# EAGLE design T01_Synth_Glove_v5_nathan_bigboard_DRC_freev2 (EAGLE 7.1.0)
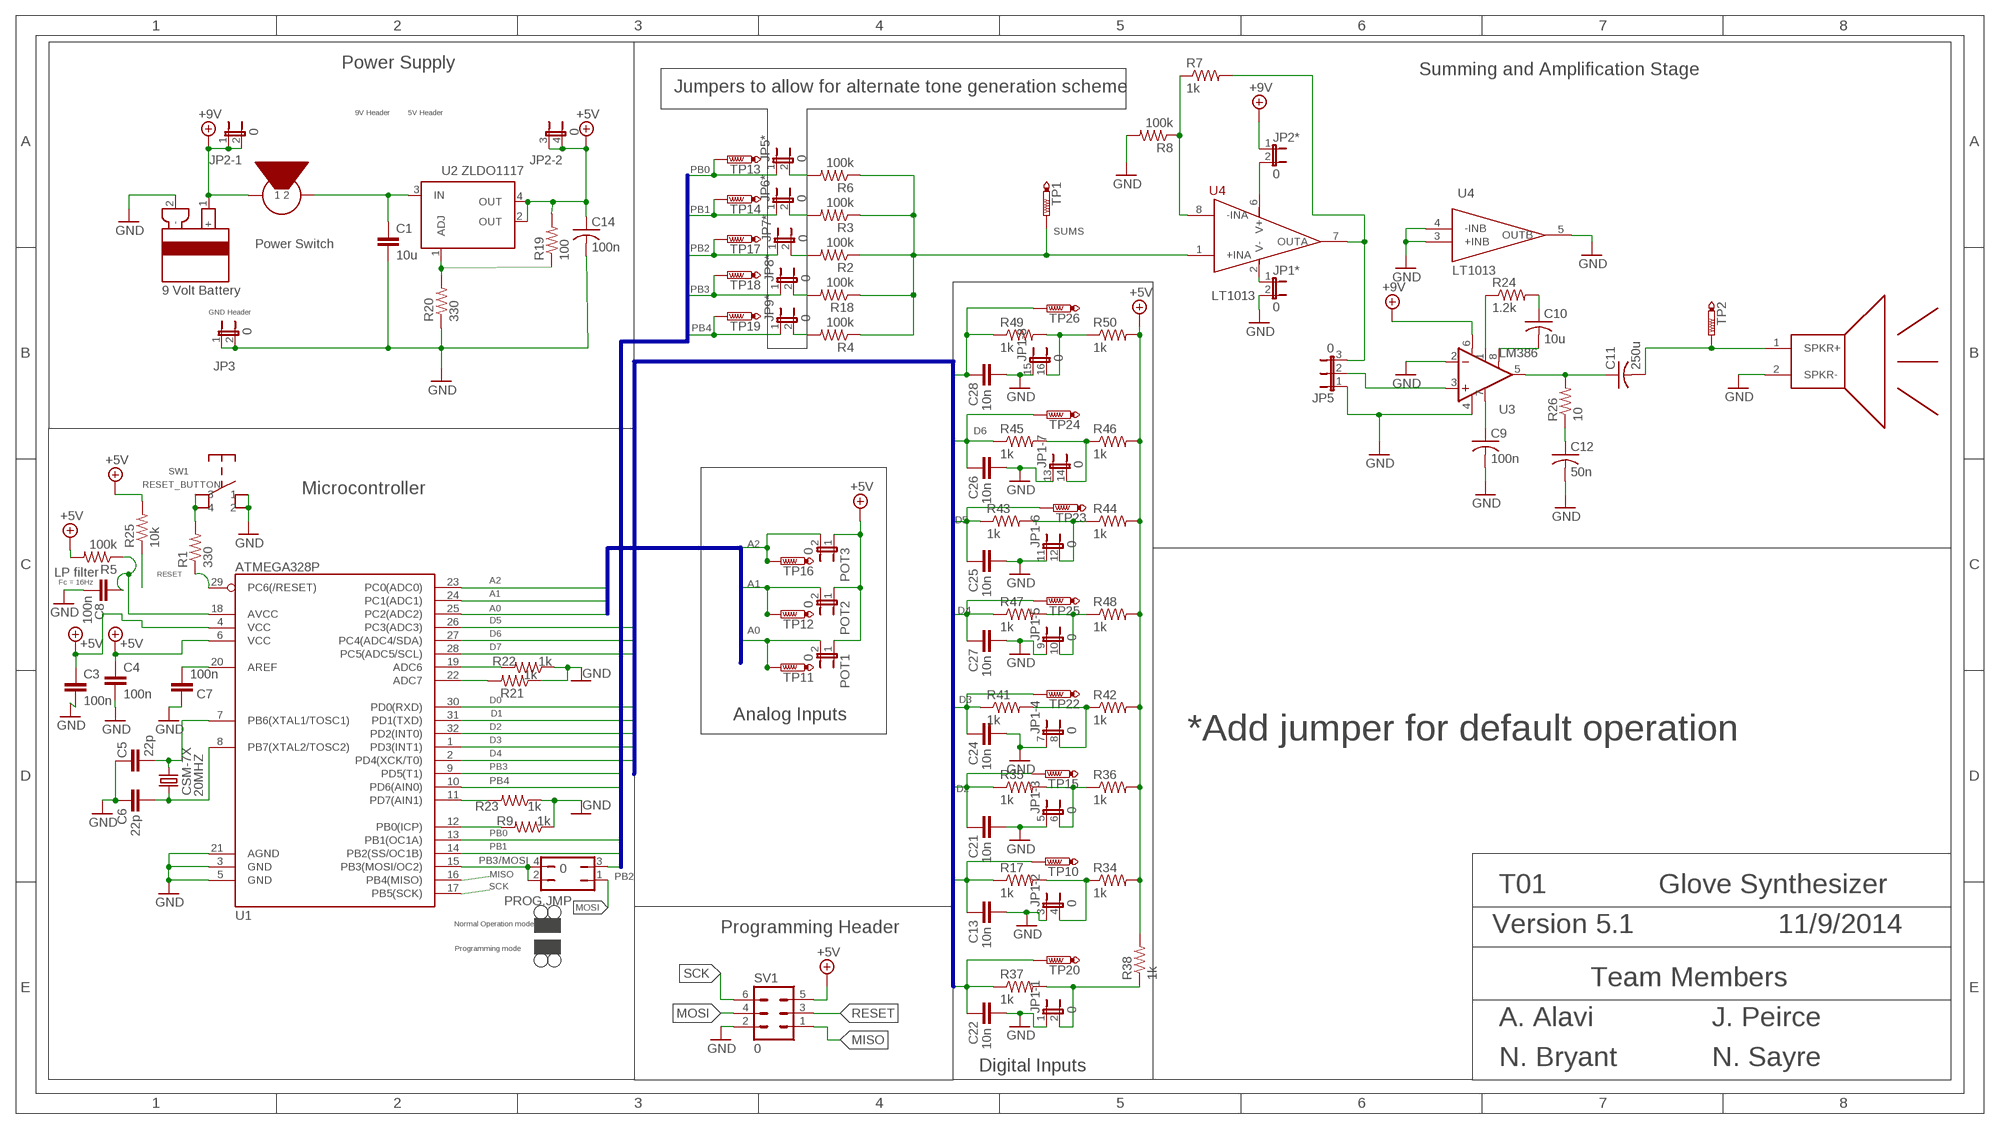
[diagram p0: schematic, sheet 1]

## Parts
20MHZ  CSM-7X  CSM-7X-DU  [CSM-7X-DU]
C1  10u  CAP0603-CAP  [0603-CAP]
C3  100n  CAP0603-CAP  [0603-CAP]
C4  100n  CAP0603-CAP  [0603-CAP]
C5  22p  CAP0603-CAP  [0603-CAP]
C6  22p  CAP0603-CAP  [0603-CAP]
C7  100n  CAP0603-CAP  [0603-CAP]
C8  100n  CAP0603-CAP  [0603-CAP]
C9  100n  C-US025-030X050  [C025-030X050]
C10  10u  C-US025-030X050  [C025-030X050]
C11  250u  C-US025-030X050  [C025-030X050]
C12  50n  C-US025-030X050  [C025-030X050]
C13  10n  CAP0603-CAP  [0603-CAP]
C14  100n  C-US025-030X050  [C025-030X050]
C21  10n  CAP0603-CAP  [0603-CAP]
C22  10n  CAP0603-CAP  [0603-CAP]
C24  10n  CAP0603-CAP  [0603-CAP]
C25  10n  CAP0603-CAP  [0603-CAP]
C26  10n  CAP0603-CAP  [0603-CAP]
C27  10n  CAP0603-CAP  [0603-CAP]
C28  10n  CAP0603-CAP  [0603-CAP]
JP1  0  JP8QE  [JP8Q]
JP1*  0  JP1E  [JP1]
JP2  0  JP2QE  [JP2Q]
JP2*  0  JP1E  [JP1]
JP3  0  JP1E  [JP1]
JP5  0  JP2E  [JP2]
JP5*  0  JP1E  [JP1]
JP6*  0  JP1E  [JP1]
JP7*  0  JP1E  [JP1]
JP8*  0  JP1E  [JP1]
JP9*  0  JP1E  [JP1]
POT1  0  JP1E  [JP1]
POT2  0  JP1E  [JP1]
POT3  0  JP1E  [JP1]
PROG.JMP  0  JP2Q  [JP2Q]
R1  330  RESISTOR0603  [0603-RES]
R2  100k  RESISTOR0603  [0603-RES]
R3  100k  RESISTOR0603  [0603-RES]
R4  100k  RESISTOR0603  [0603-RES]
R5  100k  RESISTOR0603  [0603-RES]
R6  100k  RESISTOR0603  [0603-RES]
R7  1k  RESISTOR0603  [0603-RES]
R8  100k  RESISTOR0603  [0603-RES]
R9  1k  RESISTOR0603  [0603-RES]
R17  1k  RESISTOR0603  [0603-RES]
R18  100k  RESISTOR0603  [0603-RES]
R19  100  RESISTOR0603  [0603-RES]
R20  330  RESISTOR0603  [0603-RES]
R21  1k  RESISTOR0603  [0603-RES]
R22  1k  RESISTOR0603  [0603-RES]
R23  1k  RESISTOR0603  [0603-RES]
R24  1.2k  R-US_0204/2V  [0204V]
R25  10k  RESISTOR0603  [0603-RES]
R26  10  R-US_0204/2V  [0204V]
R34  1k  RESISTOR0603  [0603-RES]
R35  1k  RESISTOR0603  [0603-RES]
R36  1k  RESISTOR0603  [0603-RES]
R37  1k  RESISTOR0603  [0603-RES]
R38  1k  RESISTOR0603  [0603-RES]
R41  1k  RESISTOR0603  [0603-RES]
R42  1k  RESISTOR0603  [0603-RES]
R43  1k  RESISTOR0603  [0603-RES]
R44  1k  RESISTOR0603  [0603-RES]
R45  1k  RESISTOR0603  [0603-RES]
R46  1k  RESISTOR0603  [0603-RES]
R47  1k  RESISTOR0603  [0603-RES]
R48  1k  RESISTOR0603  [0603-RES]
R49  1k  RESISTOR0603  [0603-RES]
R50  1k  RESISTOR0603  [0603-RES]
SV1  0  MA03-2  [MA03-2]
SW1  RESET_BUTTON  [RESET_BUTTON]
TP1  PTR1B2,54  [B2,54]
TP2  PTR1B2,54  [B2,54]
TP10  PTR1B2,54  [B2,54]
TP11  PTR1B2,54  [B2,54]
TP12  PTR1B2,54  [B2,54]
TP13  PTR1B2,54  [B2,54]
TP14  PTR1B2,54  [B2,54]
TP15  PTR1B2,54  [B2,54]
TP16  PTR1B2,54  [B2,54]
TP17  PTR1B2,54  [B2,54]
TP18  PTR1B2,54  [B2,54]
TP19  PTR1B2,54  [B2,54]
TP20  PTR1B2,54  [B2,54]
TP22  PTR1B2,54  [B2,54]
TP23  PTR1B2,54  [B2,54]
TP24  PTR1B2,54  [B2,54]
TP25  PTR1B2,54  [B2,54]
TP26  PTR1B2,54  [B2,54]
U1  ATMEGA328P  ATMEGA328_SMT  [TQFP32-08]
U2  ZLDO1117  [SOT223]
U3  LM386  [DIP08]
U4  LT1013  [SO08]
U$1  SPEAKER  [JP1]
U$7  POWER_SWITCH  [JP1]
U$8  9VOLTBATTERY  [JP1]

## Nets
+5V: C3.1 C4.1 C14.1 JP2.3 JP2.4 POT1.1 POT2.1 POT3.1 R5.2 R19.2 R25.2 R34.2 R36.2 R38.2 R42.2 R44.2 R46.2 R48.2 R50.2 SV1.5 U1.4(VCC) U1.6(VCC) U2.2(OUT) U2.4(OUT)
+9V: JP2*.1 JP2.1 JP2.2 U3.6(V+) U$7.1 U$8.1(+)
A0: POT1.2 TP11.TP U1.25(PC2(ADC2))
A1: POT2.2 TP12.TP U1.24(PC1(ADC1))
A2: POT3.2 TP16.TP U1.23(PC0(ADC0))
D0: C22.2 R37.1 TP20.TP U1.30(PD0(RXD))
D1: C13.2 R17.1 TP10.TP U1.31(PD1(TXD))
D2: C21.2 R35.1 TP15.TP U1.32(PD2(INT0))
D3: C24.2 R41.1 TP22.TP U1.1(PD3(INT1))
D4: C27.2 R47.1 TP25.TP U1.2(PD4(XCK/T0))
D5: C25.2 R43.1 TP23.TP U1.26(PC3(ADC3))
D6: C26.2 R45.1 TP24.TP U1.27(PC4(ADC4/SDA))
D7: C28.2 R49.1 TP26.TP U1.28(PC5(ADC5/SCL))
GND: C1.2 C3.2 C4.2 C5.2 C6.2 C7.2 C8.2 C9.2 C12.2 C13.1 C14.2 C21.1 C22.1 C24.1 C25.1 C26.1 C27.1 C28.1 JP1*.2 JP1.1 JP1.3 JP1.5 JP1.7 JP1.9 JP1.11 JP1.13 JP1.15 JP3.1 JP3.2 JP5.1 R8.2 R9.1 R20.1 R21.1 R22.1 R23.1 SV1.2 SW1.1 SW1.2 U1.3(GND) U1.5(GND) U1.21(AGND) U3.2(-IN) U3.4(V-) U4.3(+INB) U4.4(-INB) U4.5(OUTB) U$1.2(SPKR-) U$8.2(-)
MISO: SV1.1 U1.16(PB4(MISO))
MOSI: PROG.JMP.1 SV1.4
N$1: C7.1 U1.20(AREF)
N$2: JP1.8 R41.2 R42.1
N$3: JP1.12 R43.2 R44.1
N$4: R1.1 U1.29(PC6(/RESET))
N$6: 20MHZ.1 C5.1 U1.7(PB6(XTAL1/TOSC1))
N$7: 20MHZ.2 C6.1 U1.8(PB7(XTAL2/TOSC2))
N$8: C8.1 R5.1 U1.18(AVCC)
N$9: R21.2 U1.22(ADC7)
N$10: R22.2 U1.19(ADC6)
N$13: JP1.6 R35.2 R36.1
N$16: R7.1 R8.1 U4.8(-INA)
N$17: R9.2 U1.12(PB0(ICP))
N$18: JP5*.2 R6.2
N$21: JP9*.2 R4.2
N$22: R1.2 SW1.3 SW1.4
N$23: JP1.4 R17.2 R34.1
N$25: JP8*.2 R18.2
N$27: C10.1 R24.2
N$31: C11.2 TP2.TP U$1.1(SPKR+)
N$32: JP7*.2 R2.2
N$34: JP2*.2 U4.6(V+)
N$36: JP5.3 R7.2 U4.7(OUTA)
N$37: R19.1 R20.2 U2.1(ADJ)
N$38: C1.1 U2.3(IN) U$7.2
N$39: JP6*.2 R3.2
N$40: R24.1 U3.1(GAIN)
N$41: C10.2 U3.8(GAIN)
N$43: JP1.2 R37.2 R38.1
N$44: JP5.2 U3.3(+IN)
N$47: C9.1 U3.7(BP)
N$49: C11.1 R26.2 U3.5(OUT)
N$50: C12.1 R26.1
N$51: JP1.14 R45.2 R46.1
N$52: JP1.10 R47.2 R48.1
N$53: JP1.16 R49.2 R50.1
PB0: JP5*.1 TP13.TP U1.13(PB1(OC1A))
PB1: JP6*.1 TP14.TP U1.14(PB2(SS/OC1B))
PB2: JP7*.1 PROG.JMP.3 TP17.TP
PB3: JP8*.1 TP18.TP U1.9(PD5(T1))
PB3/MOSI: PROG.JMP.2 PROG.JMP.4 U1.15(PB3(MOSI/OC2))
PB4: JP9*.1 TP19.TP U1.10(PD6(AIN0))
PD7: R23.2 U1.11(PD7(AIN1))
RESET: R25.1 SV1.3
SCK: SV1.6 U1.17(PB5(SCK))
SUMS: R2.1 R3.1 R4.1 R6.1 R18.1 TP1.TP U4.1(+INA)
V-: JP1*.1 U4.2(V-)

## Buses
D[0..7]
PB[0..4]
A[0..2]

## Notes on the sheet
- Power Supply
- Summing and Amplification Stage
- Jumpers to allow for alternate tone generation scheme
- 9V Header | 5V Header
- Power Switch
- GND Header
- Microcontroller
- LP filter
- Fc = 16Hz
- Analog Inputs
- *Add jumper for default operation
- T01 | Glove Synthesizer
- Normal Operation mode
- Programming Header | Version 5.1 | 11/9/2014
- Programming mode
- Team Members
- A. Alavi | J. Peirce
- Digital Inputs
- N. Bryant | N. Sayre

## Library data of the parts
20MHZ = crystal:CSM-7X-DU: SMD CRYSTAL Source: www.ecsxtal.com .. Crystal 3.6864MHz CSM_7X_DU.PDF; OC_FARNELL: unknown; OC_NEWARK: unknown
C1 C3-C8 C13 C21 C22 C24-C28 = SparkFun-Capacitors:CAP: Capacitor Standard 0603 ceramic capacitor, and 0.1" leaded capacitor.
C9-C12 C14 = adafruit:C-US: CAPACITOR, American symbol
JP1 = jumper:JP8QE: JUMPER
JP1* JP2* JP3 JP5* JP6* JP7* JP8* JP9* POT1-POT3 = jumper:JP1E: JUMPER
JP2 = jumper:JP2QE: JUMPER
JP5 = jumper:JP2E: JUMPER
PROG.JMP = jumper:JP2Q: JUMPER
R1-R9 R17-R23 R25 R34-R38 R41-R50 = SparkFun-Resistors:RESISTOR: Resistor Basic schematic elements and footprints for 0603, 1206, and PTH resistors.
R24 R26 = adafruit:R-US_: RESISTOR, American symbol
SV1 = con-lstb:MA03-2: PIN HEADER; OC_FARNELL: unknown; OC_NEWARK: unknown
SW1 = Synth_Glove:RESET_BUTTON
TP1 TP2 TP10-TP20 TP22-TP26 = testpad:PTR1: TEST PIN
U1 = SparkFun-DigitalIC:ATMEGA328_SMT: 32-Pin Atmega328 part Commonly used on Arduino compatible boards Available in QFP and QFN packages TQFP is IC-09069 QFN is non-stock; PROD_ID: IC-09069
U2 = Synth_Glove:ZLDO1117
U3 = SparkFun-AnalogIC:LM386: low voltage audio power amplifier
U4 = Synth_Glove:LT1013: Linear Technology dual input precision op amps
U$1 = Synth_Glove:SPEAKER
U$7 = Synth_Glove:POWER_SWITCH
U$8 = Synth_Glove:9VOLTBATTERY

## Board
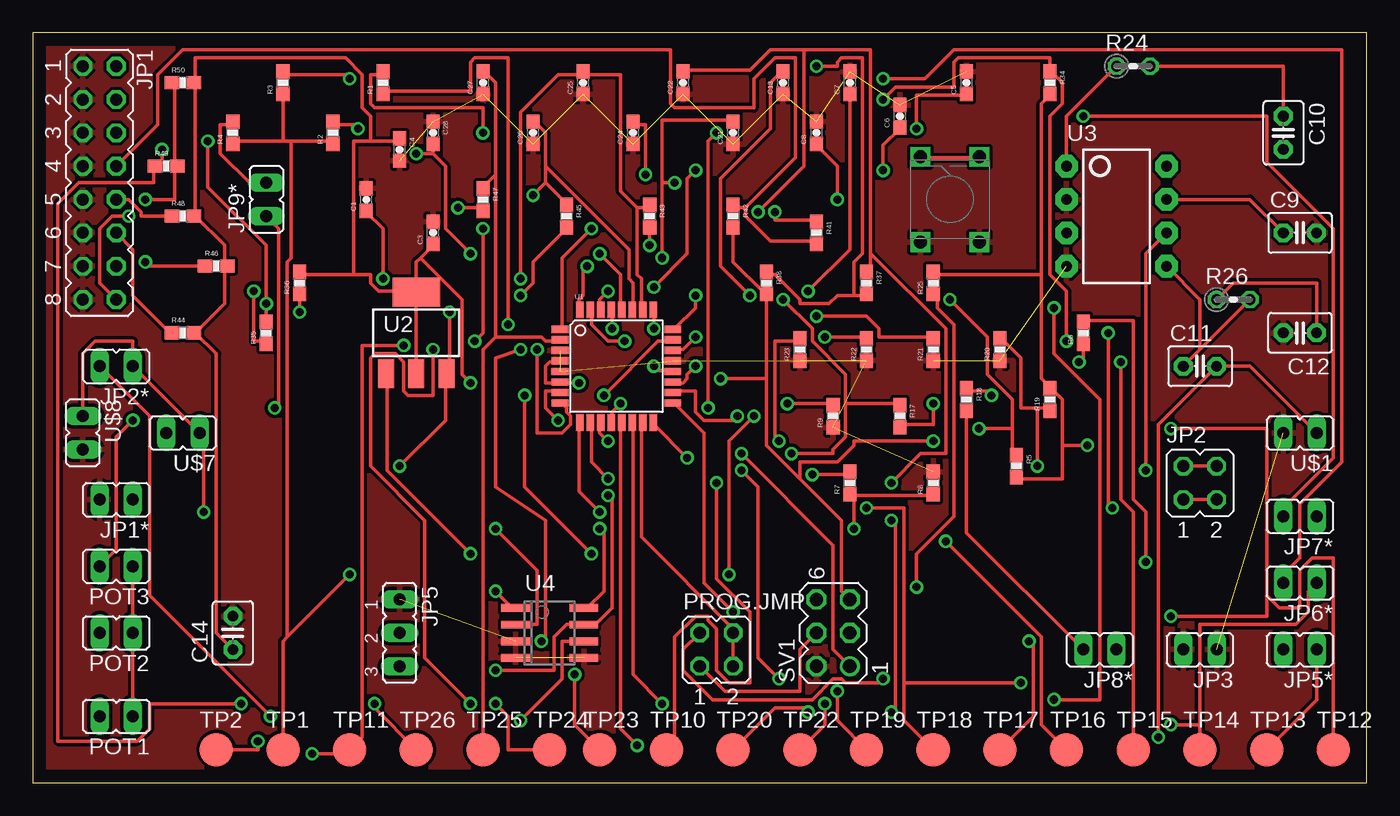
[diagram p1: board, top side]
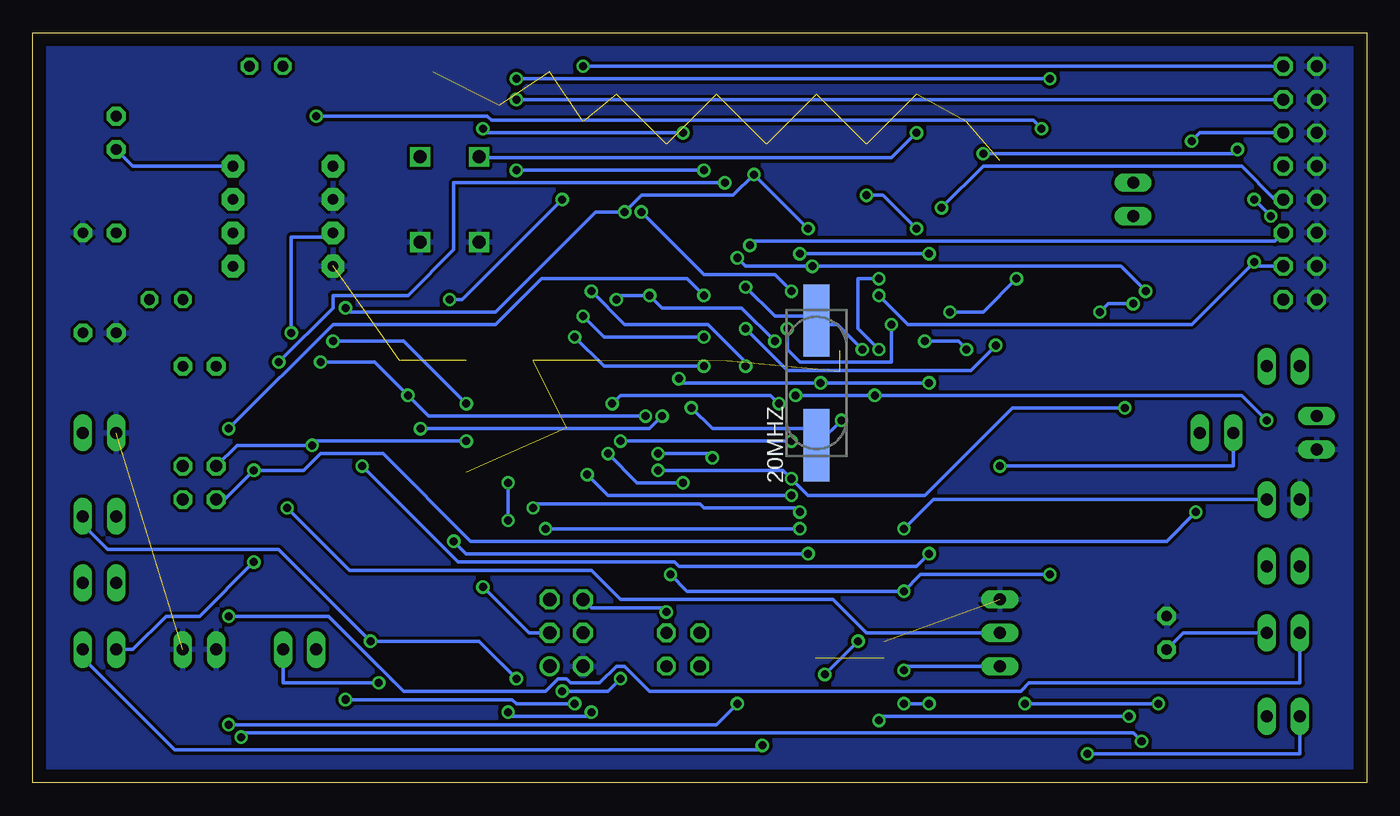
[diagram p2: board, bottom side, seen from below]

Size 101.6 x 57.15 mm. Coordinates in mm from the lower left corner, seen from the top.
Outline: 0,0 101.6,0 101.6,57.15 0,57.15 0,0
Copper layers (1*16): Top 0.035mm / dielectric 1.5mm / Bottom 0.035mm
Design rules "default": minimum track width 10mil, minimum drill 24mil, track to track 8mil, track to pad 8mil, pad to pad 8mil, via to via 8mil, smd to smd 8mil, copper to edge 40mil, drill to drill 8mil, minimum pad ring 10mil, minimum via ring 8mil, stop-mask expansion 4mil, vias tented up to drill 0mil, thermal gap 10mil

### Footprints (pad centres in the part's own frame; a part is rotated, then mirrored left to right if it is on the bottom)
CSM-7X-DU = smd 5.5 x 2: 1 -4.75,0; 2 4.75,0
0603-CAP = smd 1.1 x 1: 1 -0.85,0; 2 0.85,0
C025-030X050 = drill 0.813 pad 1.422 octagon: 1 -1.27,0; 2 1.27,0
JP8Q = drill 0.914 octagon: 1 -8.89,-1.27; 2 -8.89,1.27; 3 -6.35,-1.27; 4 -6.35,1.27; 5 -3.81,-1.27; 6 -3.81,1.27; 7 -1.27,-1.27; 8 -1.27,1.27; 9 1.27,-1.27; 10 1.27,1.27; 11 3.81,-1.27; 12 3.81,1.27; 13 6.35,-1.27; 14 6.35,1.27; 15 8.89,-1.27; 16 8.89,1.27
JP1 = drill 0.914 long: 1 0,-1.27; 2 0,1.27
JP2Q = drill 0.914 octagon: 1 -1.27,-1.27; 2 1.27,-1.27; 3 -1.27,1.27; 4 1.27,1.27
JP2 = drill 0.914 long: 1 -2.54,0; 2 0,0; 3 2.54,0
0603-RES = smd 1.1 x 1: 1 -0.85,0; 2 0.85,0
0204V = drill 0.813 octagon: 1 -1.27,0; 2 1.27,0
MA03-2 = drill 1.016: 1 -2.54,-1.27 | drill 1.016 octagon: 2 -2.54,1.27; 3 0,-1.27; 4 0,1.27; 5 2.54,-1.27; 6 2.54,1.27
RESET_BUTTON = drill 0.991 square: 1 3.251,2.248; 2 3.251,-2.248; 3 -3.251,2.248; 4 -3.251,-2.248
B2,54 = smd 2.54 x 2.54: TP 0,0
TQFP32-08 = smd 1.27 x 0.559: 1 -4.293,2.8; 2 -4.293,2; 3 -4.293,1.2; 4 -4.293,0.4; 5 -4.293,-0.4; 6 -4.293,-1.2; 7 -4.293,-2; 8 -4.293,-2.8; 17 4.293,-2.8; 18 4.293,-2; 19 4.293,-1.2; 20 4.293,-0.4; 21 4.293,0.4; 22 4.293,1.2; 23 4.293,2; 24 4.293,2.8 | smd 0.559 x 1.27: 9 -2.8,-4.293; 10 -2,-4.293; 11 -1.2,-4.293; 12 -0.4,-4.293; 13 0.4,-4.293; 14 1.2,-4.293; 15 2,-4.293; 16 2.8,-4.293; 25 2.8,4.293; 26 2,4.293; 27 1.2,4.293; 28 0.4,4.293; 29 -0.4,4.293; 30 -1.2,4.293; 31 -2,4.293; 32 -2.8,4.293
SOT223 = smd 1.219 x 2.235: 1 -2.311,-3.099; 2 0,-3.099; 3 2.311,-3.099 | smd 3.6 x 2.2: 4 0,3.099
DIP08 = drill 0.813 pad 1.727 octagon: 1 -3.81,-3.81; 2 -1.27,-3.81; 3 1.27,-3.81; 4 3.81,-3.81; 5 3.81,3.81; 6 1.27,3.81; 7 -1.27,3.81; 8 -3.81,3.81
SO08 = smd 0.6 x 2.2: 1 -1.905,-2.6; 2 -0.635,-2.6; 3 0.635,-2.6; 4 1.905,-2.6; 5 1.905,2.6; 6 0.635,2.6; 7 -0.635,2.6; 8 -1.905,2.6

### Placement (x,y rotation side)
20MHZ  41.91,30.48 90 bottom
C1  25.4,44.45 90 top
C3  30.48,41.91 90 top
C4  27.94,48.26 270 top
C5  71.12,53.34 90 top
C6  66.04,50.8 90 top
C7  62.23,53.34 90 top
C8  59.69,49.53 90 top
C9  96.52,41.91 0 top
C10  95.25,49.53 270 top
C11  88.9,31.75 0 top
C12  96.52,34.29 180 top
C13  57.15,53.34 90 top
C14  15.24,11.43 90 top
C21  53.34,49.53 90 top
C22  49.53,53.34 90 top
C24  45.72,49.53 90 top
C25  41.91,53.34 90 top
C26  38.1,49.53 90 top
C27  34.29,53.34 90 top
C28  30.48,49.53 270 top
JP1  5.08,45.72 270 top
JP1*  6.35,21.59 90 top
JP2  88.9,22.86 0 top
JP2*  6.35,31.75 90 top
JP3  88.9,10.16 90 top
JP5  27.94,11.43 270 top
JP5*  96.52,10.16 90 top
JP6*  96.52,15.24 90 top
JP7*  96.52,20.32 90 top
JP8*  81.28,10.16 90 top
JP9*  17.78,44.45 0 top
POT1  6.35,5.08 90 top
POT2  6.35,11.43 90 top
POT3  6.35,16.51 90 top
PROG.JMP  52.07,10.16 0 top
R1  26.67,53.34 90 top
R2  22.86,49.53 90 top
R3  19.05,53.34 90 top
R4  15.24,49.53 90 top
R5  74.93,24.13 270 top
R6  80.01,34.29 90 top
R7  62.23,22.86 90 top
R8  68.58,22.86 90 top
R9  60.96,27.94 90 top
R17  66.04,27.94 270 top
R18  71.12,29.21 270 top
R19  77.47,29.21 90 top
R20  73.66,33.02 90 top
R21  68.58,33.02 90 top
R22  63.5,33.02 90 top
R23  58.42,33.02 90 top
R24  83.82,54.61 0 top
R25  68.58,38.1 90 top
R26  91.44,36.83 0 top
R34  77.47,53.34 270 top
R35  17.78,34.29 90 top
R36  20.32,38.1 90 top
R37  63.5,38.1 270 top
R38  55.88,38.1 270 top
R41  59.69,41.91 270 top
R42  53.34,43.18 270 top
R43  46.99,43.18 270 top
R44  11.43,34.29 0 top
R45  40.64,43.18 270 top
R46  13.97,39.37 0 top
R47  34.29,44.45 270 top
R48  11.43,43.18 0 top
R49  10.16,46.99 0 top
R50  11.43,53.34 0 top
SV1  60.96,11.43 90 top
SW1  69.85,44.45 270 top
TP1  19.05,2.54 0 top
TP2  13.97,2.54 0 top
TP10  48.26,2.54 0 top
TP11  24.13,2.54 0 top
TP12  99.06,2.54 0 top
TP13  93.98,2.54 0 top
TP14  88.9,2.54 0 top
TP15  83.82,2.54 0 top
TP16  78.74,2.54 0 top
TP17  73.66,2.54 0 top
TP18  68.58,2.54 0 top
TP19  63.5,2.54 0 top
TP20  53.34,2.54 0 top
TP22  58.42,2.54 0 top
TP23  43.18,2.54 0 top
TP24  39.37,2.54 0 top
TP25  34.29,2.54 0 top
TP26  29.21,2.54 0 top
U1  44.45,31.75 0 top
U2  29.21,34.29 0 top
U3  82.55,43.18 270 top
U4  39.37,11.43 270 top
U$1  96.52,26.67 90 top
U$7  11.43,26.67 90 top
U$8  3.81,26.67 180 top

### Tracks (layer width: path | path; a pad name or v marks a point on that pad's centre or on a via)
+5V  (via drill 0.61)
  Top 0.254: JP2.4 JP2.3 | 78.42,25.72 78.42,29.21 77.47,30.16 | 78.42,25.72 78.42,23.18 74.93,23.18 R5.2 | 76.83,38.73 68.58,38.73 R25.2 | 76.83,38.73 76.83,30.8 77.47,30.16 | 77.47,30.16 R19.2 | 76.83,38.73 76.83,51.75 77.47,52.39 R34.2 | 78.42,25.72 v80.33,25.72 | R42.2 53.34,39.69 55.56,37.47 55.88,37.47 R38.2 55.88,30.8 | SV1.5 61.59,14.61 61.59,20 58.42,23.18 | 58.42,23.18 55.88,25.72 55.88,30.8 | U1.4 40.01,32.07 39.37,32.07 39.05,31.75 39.05,30.48 40.01,30.48 U1.6 40.32,30.48 v41.59,30.48 | 24.45,38.73 25.72,38.73 25.72,38.1 26.35,37.47 29.21,37.47 | 24.45,38.73 20.32,38.73 R36.2 | 29.53,40.01 29.21,39.69 29.21,37.47 | 29.53,40.01 30.48,40.96 C3.1 | 29.21,37.47 U2.4 U2.2 | 25.72,48.9 24.45,48.9 24.45,38.73 | 25.72,48.9 27.94,48.9 C4.1 | v33.34,30.48 32.7,31.11 32.7,36.83 29.53,40.01 | 12.38,34.29 14.61,36.51 14.61,39.37 | 12.38,43.18 14.61,40.96 14.61,39.37 | 14.61,39.37 R46.2 | 12.38,43.18 12.38,53.34 | 12.38,43.18 R48.2 | POT1.1 POT2.1 POT3.1 | 12.38,34.29 13.97,32.7 13.97,11.43 C14.1 | 12.38,34.29 R44.2 | 25.72,48.9 25.72,50.8 25.08,51.44 25.08,53.98 23.81,55.24 12.38,55.24 12.38,53.34 | 12.38,53.34 R50.2 | v52.39,30.8 55.88,30.8 | v68.58,26.04 62.55,26.04 62.55,25.72 61.28,24.45 58.42,24.45 58.42,23.18
  Bottom 0.254: JP2.3 86.04,25.72 v80.33,25.72 80.01,26.04 v68.58,26.04 | v33.34,30.48 v41.59,30.48 52.07,30.48 v52.39,30.8 | C14.1 13.97,11.43 POT2.1
+9V  (via drill 0.61)
  Top 0.254: U$8.1 3.81,32.7 4.76,33.66 7.62,33.66 JP2*.1 U$7.1 13.02,26.35 v13.02,20.64 | JP2.2 JP2.1 | U3.6 84.77,40.32 v84.77,23.81
  Bottom 0.254: JP2.1 87,21.59 v84.77,23.81 80.96,23.81 79.69,25.08 74.93,25.08 68.26,18.41 15.24,18.41 v13.02,20.64
A0  (via drill 0.61)
  Top 0.254: v47.31,34.61 47.31,35.88 U1.25 | v28.26,33.34 25.08,33.34 25.08,3.49 TP11.TP 24.13,2.22 v21.27,2.22
  Bottom 0.254: v47.31,34.61 44.13,31.43 30.16,31.43 v28.26,33.34 | POT1.2 5.08,2.22 v21.27,2.22
A1  (via drill 0.61)
  Top 0.254: v50.48,37.15 50.48,36.2 48.9,34.61 U1.24 | v86.68,26.99 93.98,26.99 93.98,14.29 | 93.98,14.29 94.93,13.34 96.52,13.34 96.52,16.19 97.47,17.14 99.06,17.14 TP12.TP | v86.68,12.7 93.98,12.7 93.98,14.29
  Bottom 0.254: v50.48,37.15 51.75,38.42 62.87,38.42 66.36,34.92 78.74,34.92 v86.68,26.99 | POT2.2 5.08,7.62 25.72,7.62 26.35,6.99 54.61,6.99 56.52,8.89 57.15,8.89 58.42,7.62 60.64,7.62 60.96,7.94 61.59,7.94 62.55,6.99 73.34,6.99 79.06,12.7 v86.68,12.7
A2  (via drill 0.61)
  Top 0.254: v43.5,29.53 47.62,33.66 48.58,33.66 U1.23 | v7.62,27.62 6.35,26.35 6.35,17.78 POT3.2 | TP16.TP 76.83,4.45 76.83,11.11 v69.53,18.41 | v42.55,17.46 37.47,22.54 v37.47,29.53
  Bottom 0.254: v43.5,29.53 v37.47,29.53 9.53,29.53 v7.62,27.62 | v69.53,18.41 68.58,17.46 v42.55,17.46
D0  (via drill 0.61)
  Top 0.254: 58.74,55.88 63.82,55.88 63.82,40.32 | 58.74,55.88 56.2,55.88 54.61,54.29 49.53,54.29 C22.2 | 63.82,40.32 63.82,39.37 63.5,39.05 R37.1 | v43.81,37.47 43.18,36.83 43.18,36.2 U1.30 | v55.24,43.5 58.74,46.99 58.74,55.88 | TP20.TP 56.52,5.71 59.05,5.71 v59.05,5.4 | v65.41,5.4 65.72,5.71 65.72,19.68 v65.41,20 | v65.41,22.86 67.63,25.08 69.53,25.08 69.53,34.61 63.82,40.32
  Bottom 0.254: v43.81,37.47 45.09,38.73 50.48,38.73 v55.24,43.5 | v59.05,5.4 59.37,5.08 65.09,5.08 v65.41,5.4 | v65.41,22.86 v65.41,20
D1  (via drill 0.61)
  Top 0.254: 61.91,28.89 66.04,28.89 R17.1 | 61.91,28.89 61.91,31.11 59.37,33.66 59.37,34.61 v57.15,36.83 | v54.61,37.15 52.39,39.37 52.39,46.04 56.2,49.85 56.2,53.34 57.15,54.29 C13.2 | v45.09,33.66 43.81,33.66 42.55,34.92 42.55,35.88 U1.31 | TP10.TP 48.9,3.17 48.9,11.11 50.48,12.7 51.44,12.7 51.44,12.38 52.07,11.75 52.07,8.57 53.02,7.62 54.61,7.62 54.61,13.02 52.07,15.56 v52.07,22.86 | v57.78,25.08 60.96,25.08 60.96,25.4 61.91,26.35 61.91,28.89
  Bottom 0.254: v57.15,36.83 56.83,37.15 v54.61,37.15 53.66,36.2 47.62,36.2 v45.09,33.66 | v52.07,22.86 55.56,22.86 v57.78,25.08
D2  (via drill 0.61)
  Top 0.254: v16.83,37.47 16.83,33.66 17.78,33.66 R35.1 | v42.23,39.37 41.91,39.05 41.91,37.15 41.59,36.83 41.59,36.2 U1.32 | v47.94,40.01 47.94,45.72 | 47.94,45.72 47.94,50.48 53.34,50.48 C21.2 | TP15.TP 83.82,20.64 82.87,21.59 v82.87,32.07 | 47.94,45.72 v48.9,45.72
  Bottom 0.254: v16.83,37.47 18.73,39.37 v42.23,39.37 47.31,39.37 v47.94,40.01 | v82.87,32.07 78.74,36.2 78.74,37.15 73.03,37.15 69.53,40.64 69.53,45.72 v48.9,45.72
D3  (via drill 0.61)
  Top 0.254: v46.67,46.35 46.67,50.16 45.72,50.16 C24.2 | v42.55,42.23 40.32,40.01 40.32,34.61 U1.1 | v56.52,43.5 56.52,42.86 59.69,42.86 R41.1 | TP22.TP 60.33,4.45 v60.33,6.03 | v77.79,6.35 81.28,6.35 81.28,29.21 77.79,32.7 v77.79,36.2
  Bottom 0.254: v42.55,42.23 v46.67,46.35 48.26,44.77 55.24,44.77 v56.52,43.5 58.74,43.5 66.36,35.88 77.47,35.88 v77.79,36.2 | v60.33,6.03 64.77,6.03 65.09,6.35 v77.79,6.35
D4
  Top 0.254: 35.24,46.35 34.29,45.4 R47.1 | 35.24,46.35 35.24,53.34 34.29,54.29 C27.2 | 35.24,33.97 38.73,33.97 39.05,33.66 40.01,33.66 U1.2 | 35.24,46.35 35.24,33.97 | TP25.TP 34.29,33.02 35.24,33.97
D5  (via drill 0.61)
  Top 0.254: 46.04,43.81 46.99,43.81 R43.1 | 46.04,43.81 46.04,38.73 46.35,38.42 46.35,36.2 U1.26 | 41.91,53.98 44.77,53.98 44.77,45.09 46.04,43.81 | TP23.TP 41.27,4.45 v41.27,8.26 | v38.73,10.79 39.05,11.11 39.05,20 35.24,22.54 35.24,32.38 v37.15,33.02 | v37.15,38.42 37.15,51.12 40.01,53.98 41.91,53.98 | 41.91,53.98 C25.2
  Bottom 0.254: v38.73,10.79 v41.27,8.26 | v37.15,33.02 38.73,34.61 38.73,38.42 v37.15,38.42
D6  (via drill 0.61)
  Top 0.254: 39.05,45.72 40.64,44.13 R45.1 | 39.05,46.99 39.05,49.53 38.1,50.48 C26.2 | 39.05,46.99 39.05,45.72 | 39.05,46.99 45.4,40.64 45.4,38.42 45.72,38.1 45.72,36.2 U1.27 | TP24.TP 36.2,2.54 36.2,5.08 v35.24,6.03 | v33.34,6.03 29.84,9.53 29.84,20 25.72,24.13 25.72,32.38 26.04,32.7 27.62,32.7 28.26,32.07 28.26,29.84 28.57,29.53 30.48,29.53 v30.48,33.02 | v33.66,33.66 34.29,34.29 v34.29,42.23 | 39.05,45.72 v38.1,44.77
  Bottom 0.254: v33.34,6.03 v35.24,6.03 | v30.48,33.02 31.11,33.66 v33.66,33.66 | v34.29,42.23 36.83,44.77 v38.1,44.77
D7  (via drill 0.61)
  Top 0.254: v9.84,48.26 9.84,47.31 9.53,46.99 R49.1 9.21,46.99 9.21,45.72 3.49,45.72 1.91,44.13 1.91,3.17 7.94,3.17 8.89,4.13 8.89,6.03 v15.88,6.03 | 30.48,47.94 v29.21,47.94 | C28.2 30.48,47.94 | v43.18,40.32 44.77,38.73 44.77,36.2 U1.28 | v33.34,40.32 31.43,42.23 31.43,46.99 30.48,47.94 | TP26.TP 26.04,5.71 v26.04,6.03
  Bottom 0.254: v9.84,48.26 10.16,47.94 v29.21,47.94 | v33.34,40.32 v43.18,40.32 | v15.88,6.03 v26.04,6.03
GND  (23 unrouted)
  pour Bottom (isolate 0.254): 101.6,0 0,0 0,57.15 101.6,57.15
  pour Top (isolate 0.254): 0,57.15 0,0 101.6,0 101.6,1.27 101.6,57.15
MISO  (via drill 0.61)
  Top 0.254: v49.85,24.77 47.31,27.3 U1.16 | v53.98,25.08 60.96,18.1 60.96,10.16 SV1.1
  Bottom 0.254: v49.85,24.77 50.16,25.08 v53.98,25.08
MOSI
  Top 0.254: PROG.JMP.1 52.7,6.99 58.42,6.99 58.42,10.16 SV1.4
N$1  (via drill 0.61)
  Top 0.254: C7.1 62.23,40.64 v59.05,37.47 | v47.31,31.75 47.62,31.43 48.58,31.43 U1.20
  Bottom 0.254: v59.05,37.47 56.52,34.92 50.16,34.92 47.31,32.07 v47.31,31.75
N$2
  Top 0.254: 54.29,43.81 53.34,43.81 R42.1 | 54.29,43.81 54.29,43.18 56.2,41.27 59.69,41.27 R41.2 | JP1.8 9.53,50.16 9.53,53.98 11.43,55.88 48.58,55.88 48.58,51.75 48.9,51.44 54.93,51.44 54.93,53.66 56.52,55.24 58.1,55.24 58.1,47.62 54.29,43.81
N$3  (via drill 0.61)
  Top 0.254: JP1.12 7.62,40.64 7.62,37.15 10.48,34.29 R44.1 | v46.99,40.96 R43.2
  Bottom 0.254: v46.99,40.96 46.67,41.27 6.99,41.27 JP1.12
N$4  (via drill 0.61)
  Top 0.254: v36.2,34.92 36.2,55.24 33.66,55.24 33.34,54.93 33.34,52.7 26.67,52.7 R1.1 | v44.13,34.61 44.13,35.88 U1.29
  Bottom 0.254: v36.2,34.92 36.2,32.07 43.18,32.07 44.13,33.02 v44.13,34.61
N$6  (via drill 0.61)
  Top 0.254: v67.31,49.85 67.31,52.39 71.12,52.39 C5.1 | v52.07,49.53 51.44,48.9 v51.44,28.57 | v40.01,27.62 39.05,28.57 39.05,29.84 40.01,29.84 U1.7
  Bottom 0.254: v67.31,49.85 66.99,49.53 v52.07,49.53 | v51.44,28.57 49.85,26.99 42.86,26.99 41.91,26.04 | v40.01,27.62 41.59,26.04 41.91,26.04 | 41.91,26.04 20MHZ.1
N$7  (via drill 0.61)
  Top 0.254: v64.77,46.67 64.77,48.58 66.04,49.85 C6.1 | v50.48,46.67 49.85,46.04 49.85,40.32 v47.31,37.78 | v38.42,33.02 38.42,26.67 40.32,26.67 40.96,27.3 40.96,27.94 40.64,28.26 40.64,28.57 40.32,28.89 U1.8
  Bottom 0.254: v50.48,46.67 v64.77,46.67 | v47.31,37.78 45.09,35.56 42.23,35.56 41.91,35.24 20MHZ.2 41.91,34.92 40.32,34.92 v38.42,33.02
N$8  (via drill 0.61)
  Top 0.254: v61.28,44.45 61.28,46.99 59.69,48.58 C8.1 | v69.85,36.83 72.71,33.97 72.71,31.11 74.61,29.21 74.61,26.99 | 74.61,26.99 74.61,25.4 74.93,25.08 R5.1 | v53.66,27.94 53.66,27.62 51.12,27.62 50.48,28.26 50.48,29.84 48.9,29.84 U1.18 | 74.61,26.99 v72.07,26.99
  Bottom 0.254: v61.28,44.45 68.9,36.83 v69.85,36.83 | v53.66,27.94 54.61,26.99 v72.07,26.99
N$9  (via drill 0.61)
  Top 0.254: v59.69,35.56 63.5,35.56 64.45,34.61 64.45,33.97 68.58,33.97 R21.2 | v50.48,33.97 49.53,33.02 48.9,33.02 U1.22
  Bottom 0.254: v59.69,35.56 58.1,33.97 v50.48,33.97
N$10  (via drill 0.61)
  Top 0.254: v60.33,33.97 63.5,33.97 R22.2 | v50.48,31.75 49.85,31.11 49.85,30.8 49.53,30.48 48.9,30.48 U1.19
  Bottom 0.254: v60.33,33.97 58.1,31.75 v50.48,31.75
N$13  (via drill 0.61)
  Top 0.254: R35.2 v17.78,36.51 17.78,40.96 13.34,45.4 v13.34,48.9 | v20.32,35.88 R36.1
  Bottom 0.254: v13.34,48.9 12.7,49.53 JP1.6 | v20.32,35.88 19.68,36.51 v17.78,36.51
N$16  (via drill 0.61)
  Top 0.254: 62.55,21.91 68.58,21.91 R8.1 | 62.55,21.91 62.23,21.91 R7.1 62.55,21.91 | v43.18,19.37 43.5,19.05 43.5,14.61 42.23,13.34 U4.8 | 62.55,21.91 v62.55,19.37
  Bottom 0.254: v62.55,19.37 v43.18,19.37
N$17  (via drill 0.61)
  Top 0.254: v57.47,28.89 60.96,28.89 R9.2 | v44.77,28.89 44.13,28.26 44.13,27.62 U1.12
  Bottom 0.254: v57.47,28.89 56.83,29.53 45.4,29.53 v44.77,28.89
N$18  (via drill 0.61)
  Top 0.254: v84.77,16.83 84.77,20.64 83.82,21.59 83.82,35.24 80.01,35.24 R6.2
  Bottom 0.254: v84.77,16.83 88.9,12.7 91.44,12.7 93.98,10.16 JP5*.2
N$21
  Top 0.254: JP9*.2 16.51,45.72 14.29,47.94 14.29,50.16 15.24,50.16 R4.2
N$22  (via drill 0.61)
  Top 0.254: v34.29,49.53 34.29,51.44 26.04,51.44 25.72,51.75 25.72,53.98 26.67,53.98 R1.2 | SW1.3 72.07,47.62 67.63,47.62 SW1.4
  Bottom 0.254: v34.29,49.53 36.2,47.62 67.31,47.62 SW1.4
N$23  (via drill 0.61)
  Top 0.254: v68.58,28.89 68.58,27.3 66.04,27.3 R17.2 | v78.74,33.66 78.74,37.47 77.47,38.73 77.47,50.8 78.42,51.75 78.42,53.34 77.47,54.29 | v64.77,52.07 65.72,53.02 70.17,53.02 70.17,54.93 70.48,55.24 77.47,55.24 77.47,54.29 | 77.47,54.29 R34.1
  Bottom 0.254: v68.58,28.89 73.34,33.66 v78.74,33.66 | v64.77,52.07 JP1.4
N$25
  Top 0.254: R18.2 71.12,19.05 JP8*.2
N$27
  Top 0.254: R24.2 95.25,54.61 C10.1
N$31  (via drill 0.61)
  Top 0.254: TP2.TP 17.14,2.54 v17.14,3.17 | v85.72,3.49 85.72,27.3 C11.2 92.71,31.75 U$1.1
  Bottom 0.254: v17.14,3.17 17.78,3.81 85.41,3.81 v85.72,3.49
N$32  (via drill 0.61)
  Top 0.254: v24.77,49.85 24.77,50.16 22.86,50.16 R2.2 | v80.01,50.8 93.98,50.8 93.98,47.31 99.06,42.23 99.06,24.77 95.25,20.95 JP7*.2
  Bottom 0.254: v24.77,49.85 25.4,50.48 66.67,50.48 66.99,50.8 v80.01,50.8
N$34  (via drill 0.61)
  Top 0.254: U4.6 40.32,10.79 40.32,7.94 v37.15,4.76 | v18.1,5.08 8.89,14.29 8.89,27.94 JP2*.2
  Bottom 0.254: v37.15,4.76 36.83,5.08 v18.1,5.08
N$36  (via drill 0.61)
  Top 0.254: v59.37,23.5 62.23,23.5 R7.2 | v43.81,21.91 44.13,21.59 44.13,13.34 42.86,12.06 U4.7 40.64,12.06 39.69,11.11 39.69,8.57 v35.24,8.57
  Bottom 0.254: v59.37,23.5 57.78,21.91 v43.81,21.91 | JP5.3 34.92,8.89 v35.24,8.57
N$37  (via drill 0.61)
  Top 0.254: 76.52,28.57 75.25,28.57 75.25,32.38 73.66,33.97 R20.2 | 76.52,28.57 77.47,28.57 R19.1 | v33.34,17.46 26.99,23.81 26.99,31.11 U2.1 | 76.52,28.57 v76.52,24.13
  Bottom 0.254: v33.34,17.46 34.29,16.51 52.39,16.51 52.7,16.83 69.22,16.83 v76.52,24.13
N$38  (via drill 0.61)
  Top 0.254: v26.67,38.42 26.67,42.23 25.4,43.5 C1.1 | v31.75,35.88 31.75,31.43 U2.3 31.43,31.11 31.43,27.62 v27.94,24.13
  Bottom 0.254: v26.67,38.42 29.21,35.88 v31.75,35.88 | U$7.2 10.16,24.13 v27.94,24.13
N$39  (via drill 0.61)
  Top 0.254: v24.13,53.66 24.13,53.98 19.05,53.98 R3.2 | v64.77,53.66 67.94,53.66 70.17,55.88 99.69,55.88 99.69,24.45 96.52,21.27 96.52,17.14 95.25,15.88 JP6*.2
  Bottom 0.254: v64.77,53.66 v24.13,53.66
N$40
  Top 0.254: R24.1 78.74,50.8 U3.1
N$41
  Bottom 0.254: C10.2 93.98,46.99 U3.8
N$43  (via drill 0.61)
  Top 0.254: 62.55,37.15 61.28,37.15 60.64,36.51 58.42,36.51 58.42,36.83 56.52,38.73 55.88,38.73 R38.1 | 62.55,37.15 63.5,37.15 R37.2 | v59.69,54.61 61.28,54.61 61.28,54.93 61.59,55.24 63.18,55.24 63.18,40.32 62.55,39.69 62.55,37.15
  Bottom 0.254: v59.69,54.61 JP1.2
N$44  (via drill 0.61)
  Top 0.254: v82.23,20.95 81.92,21.27 v81.92,34.29
  Bottom 0.254: JP5.2 38.1,11.43 40.64,13.97 56.83,13.97 59.05,16.19 77.47,16.19 v82.23,20.95 | v81.92,34.29 81.92,41.59 79.06,41.59 U3.3
N$47
  Top 0.254: C9.1 92.71,44.45 U3.7
N$49
  Top 0.254: C11.1 88.9,33.02 | 88.9,33.02 R26.2 | U3.5 88.9,36.83 88.9,33.02
N$50
  Top 0.254: R26.1 91.44,38.1 97.79,38.1 C12.1
N$51  (via drill 0.61)
  Top 0.254: R46.1 8.57,39.37 v8.57,39.69 | v37.15,37.15 38.1,38.1 38.1,39.69 40.64,42.23 R45.2
  Bottom 0.254: JP1.14 8.26,39.37 v8.57,39.69 13.34,34.92 34.92,34.92 v37.15,37.15
N$52  (via drill 0.61)
  Top 0.254: R48.1 8.26,43.18 8.26,43.5 7.3,44.45 JP1.10 | v32.38,43.81 34.29,43.81 R47.2
  Bottom 0.254: v32.38,43.81 29.21,46.99 9.53,46.99 6.99,44.45 JP1.10
N$53  (via drill 0.61)
  Top 0.254: 10.79,46.99 10.79,53.34 R50.1 | JP1.16 5.08,38.1 5.08,42.23 6.03,43.18 v7.3,43.18 | v8.57,44.45 10.79,44.45 10.79,46.99 | 10.79,46.99 R49.2
  Bottom 0.254: v8.57,44.45 v7.3,43.18
PB0  (via drill 0.61)
  Top 0.254: v46.04,2.86 44.77,4.13 44.77,27.3 U1.13 | TP13.TP 97.79,6.35 JP5*.1
  Bottom 0.254: v46.04,2.86 46.35,2.54 90.81,2.54 97.79,9.53 JP5*.1
PB1  (via drill 0.61)
  Top 0.254: v47.94,6.03 45.72,8.26 45.72,27.3 U1.14 | 88.9,4.45 v86.68,4.45 | TP14.TP 88.9,4.45 | JP6*.1 97.16,14.61 97.16,13.02 96.2,12.06 88.9,12.06 88.9,4.45
  Bottom 0.254: v47.94,6.03 49.53,4.45 v86.68,4.45
PB2  (via drill 0.61)
  Top 0.254: TP17.TP 76.2,5.08 76.2,10.48 v75.88,10.79 | PROG.JMP.3 49.53,10.16 49.53,8.57 51.75,6.35 59.37,6.35 60.96,7.94 61.59,7.94 61.91,7.62 64.77,7.62 v64.77,7.94
  Bottom 0.254: JP7*.1 97.79,19.68 95.89,17.78 82.87,17.78 v75.88,10.79 67.63,10.79 v64.77,7.94
PB3  (via drill 0.61)
  Top 0.254: v43.18,20.64 41.59,22.23 41.59,27.3 U1.9 | v63.5,20.95 66.36,20.95 66.36,7.62 | 66.36,7.62 66.36,4.76 TP18.TP | 66.36,7.62 v75.25,7.62
  Bottom 0.254: v43.18,20.64 43.5,20.95 50.48,20.95 50.8,21.27 63.18,21.27 v63.5,20.95 | JP8*.1 82.55,7.62 v75.25,7.62
PB3/MOSI
  Top 0.254: U1.15 46.35,27.3 46.35,18.73 53.34,11.75 PROG.JMP.4 PROG.JMP.2
PB4  (via drill 0.61)
  Top 0.254: v43.81,23.18 42.55,24.45 42.55,27.3 U1.10 | v18.41,28.57 18.73,28.89 18.73,42.23 JP9*.1 | TP19.TP 61.28,4.76 v61.28,6.99 | v56.83,7.94 55.24,9.53 55.24,22.54 v53.98,23.81
  Bottom 0.254: v18.41,28.57 26.99,28.57 33.66,21.91 42.55,21.91 v43.81,23.18 44.45,23.81 v53.98,23.81 | v61.28,6.99 57.78,6.99 v56.83,7.94
PD7  (via drill 0.61)
  Top 0.254: v56.83,26.04 56.52,26.35 56.52,33.66 58.42,33.66 R23.2 | v43.81,26.04 43.18,26.67 43.18,27.3 U1.11
  Bottom 0.254: v43.81,26.04 v56.83,26.04
RESET  (via drill 0.61)
  Top 0.254: v67.31,14.92 67.31,17.46 70.17,20.32 70.17,34.92 68.9,36.2 68.9,36.83 68.58,37.15 R25.1
  Bottom 0.254: v67.31,14.92 63.82,11.43 SV1.3
SCK  (via drill 0.61)
  Top 0.254: v53.34,13.02 51.12,15.24 51.12,26.67 48.9,28.89 U1.17
  Bottom 0.254: v53.34,13.02 53.66,13.34 59.05,13.34 SV1.6
SUMS  (via drill 0.61)
  Top 0.254: v73.03,29.53 73.03,29.84 71.12,29.84 R18.1 | v79.69,32.07 80.01,32.38 R6.1 | 19.05,48.9 15.24,48.9 R4.1 | R3.1 19.05,48.9 | 19.05,48.9 19.68,48.9 | 19.68,48.9 22.86,48.9 R2.1 | v35.24,14.61 36.51,13.34 U4.1 | 19.37,11.11 19.05,10.79 TP1.TP | 19.37,11.11 v24.13,15.88 | 19.68,48.9 19.68,40.01 19.37,39.69 19.37,11.11 | v54.93,27.94 53.02,26.04 v53.02,15.88
  Bottom 0.254: v79.69,32.07 75.56,32.07 v73.03,29.53 71.44,27.94 v54.93,27.94 | v24.13,15.88 33.97,15.88 v35.24,14.61 51.75,14.61 v53.02,15.88
V-  (via drill 0.61)
  Top 0.254: U4.2 38.42,12.06 38.42,16.19 v35.24,19.37
  Bottom 0.254: v35.24,19.37 33.02,21.59 JP1*.1